# EAGLE design master (EAGLE 5.11)
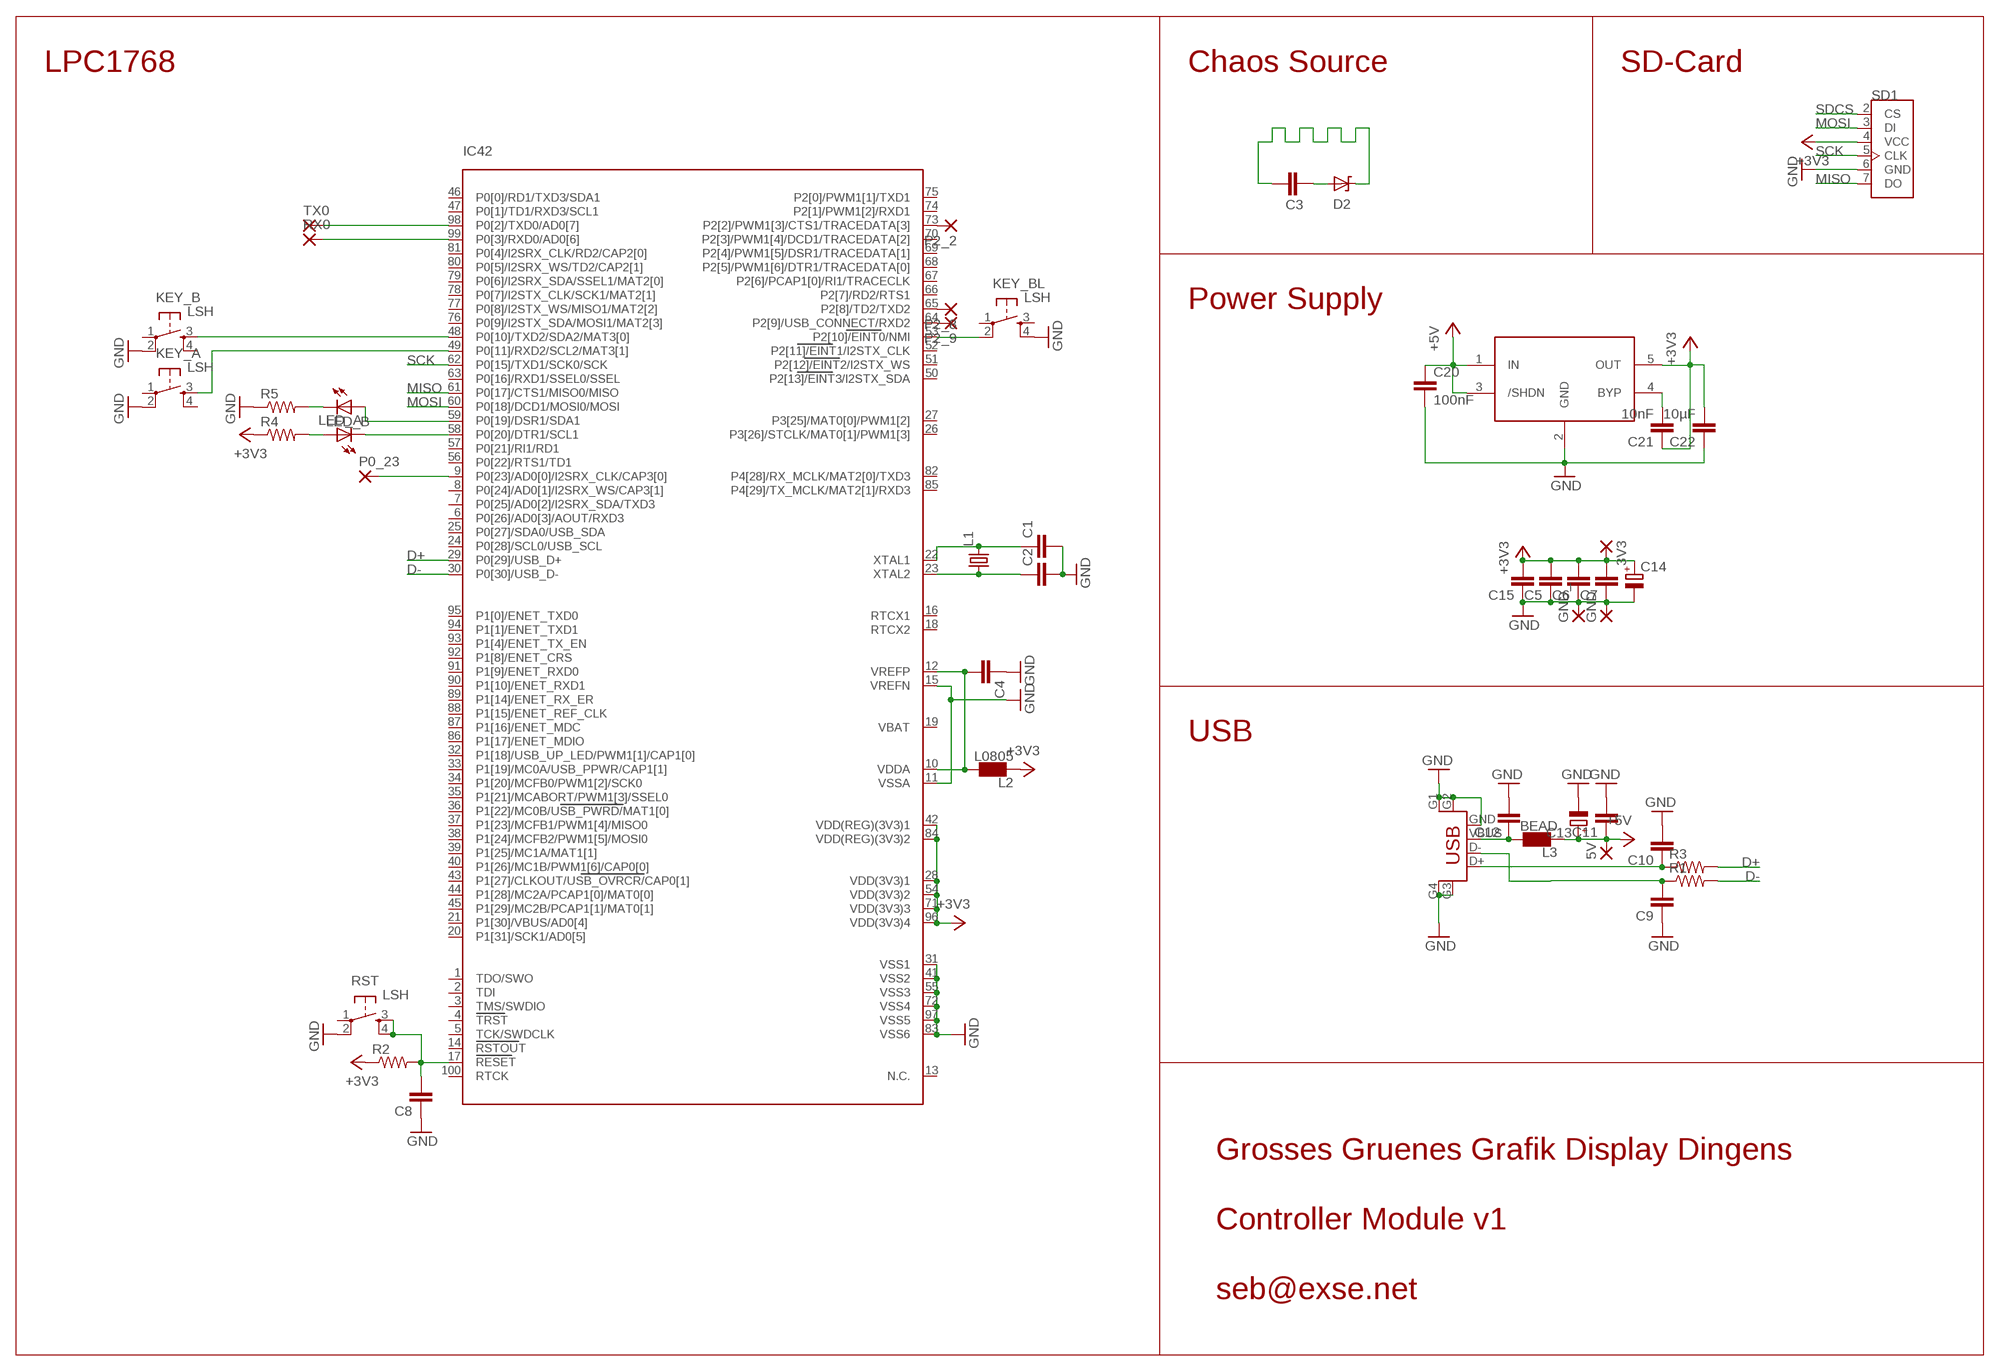
[diagram p0: schematic, sheet 1]

## Parts
3V3  SMD5  [SMD2,54-5,08]
5V  SMD5  [SMD2,54-5,08]
C1  CAP0805  [0805]
C2  CAP0805  [0805]
C3  CAP0805  [0805]
C4  CAP0805  [0805]
C5  CAP0805  [0805]
C6  CAP0805  [0805]
C7  CAP0805  [0805]
C8  CAP0805  [0805]
C9  CAP0805  [0805]
C10  CAP0805  [0805]
C11  CAP0805  [0805]
C12  CAP0805  [0805]
C13  CPOL-EUSMCC  [SMC_C]
C14  CPOL-EUSMCC  [SMC_C]
C15  CAP0805  [0805]
C20  100nF  CAP0805  [0805]
C21  10nF  CAP0805  [0805]
C22  10µF  CAP0805  [0805]
D2  DIODE-ZENER-BZT52  [SOD-323]
GND  SMD5  [SMD2,54-5,08]
GND_  SMD5  [SMD2,54-5,08]
IC23  LT1761  [SOT23-5L]
IC42  LPC1768  [LQFP100]
KEY_A  LSH  [LSH]
KEY_B  LSH  [LSH]
KEY_BL  LSH  [LSH]
L1  X22-OSCILLATOR  [X22]
L2  L0805  [0805]
L3  BEAD  [0805]
LED_A  LEDCHIPLED_0805  [CHIPLED_0805]
LED_B  LEDCHIPLED_0805  [CHIPLED_0805]
P0_23  SMD5  [SMD2,54-5,08]
P2_2  SMD5  [SMD2,54-5,08]
P2_8  SMD5  [SMD2,54-5,08]
P2_9  SMD5  [SMD2,54-5,08]
R1  RESISTOR0805-RES  [0805]
R2  RESISTOR0805-RES  [0805]
R3  RESISTOR0805-RES  [0805]
R4  RESISTOR0805-RES  [0805]
R5  RESISTOR0805-RES  [0805]
RST  LSH  [LSH]
RX0  SMD5  [SMD2,54-5,08]
SD1  MICROSD_SF-MICROSD  [MICROSD_MICROSD]
TX0  SMD5  [SMD2,54-5,08]
X1  USB-SMD-NS  [USB-MINIB-NOSTOP]

## Nets
+3V3: 3V3.1(P) C5.2 C6.2 C7.2 C14.+ C15.2 C21.1 C22.2 IC23.5(OUT) IC42.28(VDD(3V3)1) IC42.42(VDD(REG)(3V3)1) IC42.54(VDD(3V3)2) IC42.71(VDD(3V3)3) IC42.84(VDD(REG)(3V3)2) IC42.96(VDD(3V3)4) L2.2 R2.1 R4.1 SD1.4(VCC)
+5V: 5V.1(P) C11.1 C13.+ C20.1 IC23.1(IN) IC23.3(/SHDN) L3.2
D+: IC42.29(P0[29]/USB_D+) R3.2
D-: IC42.30(P0[30]/USB_D-) R1.2
GND: C1.2 C2.2 C4.1 C5.1 C6.1 C7.1 C8.1 C9.1 C10.2 C11.2 C12.2 C13.- C14.- C15.1 C20.2 C22.1 GND.1(P) GND_.1(P) IC23.2(GND) IC42.11(VSSA) IC42.15(VREFN) IC42.31(VSS1) IC42.41(VSS2) IC42.55(VSS3) IC42.72(VSS4) IC42.83(VSS6) IC42.97(VSS5) KEY_A.2 KEY_B.2 KEY_BL.4 R5.1 RST.2 SD1.6(GND) X1.G1(GND) X1.G2(GND) X1.G3(GND) X1.G4(GND) X1.GND
MISO: IC42.61(P0[17]/CTS1/MISO0/MISO) SD1.7(DO)
MOSI: IC42.60(P0[18]/DCD1/MOSI0/MOSI) SD1.3(DI)
N$1: C1.1 IC42.22(XTAL1) L1.3
N$2: C2.1 IC42.23(XTAL2) L1.1
N$3: C9.2 R1.1 X1.D-
N$4: IC42.53(P2[10]/EINT0/NMI) KEY_BL.2
N$5: C10.1 R3.1 X1.D+
N$6: C4.2 IC42.10(VDDA) IC42.12(VREFP) L2.1
N$7: C3.2 D2.1(C)
N$8: IC42.99(P0[3]/RXD0/AD0[6]) RX0.1(P)
N$9: C12.1 L3.1 X1.VBUS
N$10: IC42.98(P0[2]/TXD0/AD0[7]) TX0.1(P)
N$11: IC42.9(P0[23]/AD0[0]/I2SRX_CLK/CAP3[0]) P0_23.1(P)
N$12: C8.2 IC42.17(RESET) R2.2 RST.3 RST.4
N$13: IC42.48(P0[10]/TXD2/SDA2/MAT3[0]) KEY_B.3
N$14: IC42.49(P0[11]/RXD2/SCL2/MAT3[1]) KEY_A.3
N$15: IC42.58(P0[20]/DTR1/SCL1) LED_A.C
N$16: IC42.59(P0[19]/DSR1/SDA1) LED_B.A
N$17: LED_A.A R4.2
N$18: LED_B.C R5.2
N$19: IC42.64(P2[9]/USB_CONNECT/RXD2) P2_9.1(P)
N$20: IC42.65(P2[8]/TD2/TXD2) P2_8.1(P)
N$21: IC42.73(P2[2]/PWM1[3]/CTS1/TRACEDATA[3]) P2_2.1(P)
N$22: C3.1 D2.2(A)
N$43: C21.2 IC23.4(BYP)
SCK: IC42.62(P0[15]/TXD1/SCK0/SCK) SD1.5(CLK)
SDCS: SD1.2(CS)
Unconnected: IC42.1(TDO/SWO) IC42.2(TDI) IC42.3(TMS/SWDIO) IC42.4(TRST) IC42.5(TCK/SWDCLK) IC42.6(P0[26]/AD0[3]/AOUT/RXD3) IC42.7(P0[25]/AD0[2]/I2SRX_SDA/TXD3) IC42.8(P0[24]/AD0[1]/I2SRX_WS/CAP3[1]) IC42.13(N.C.) IC42.14(RSTOUT) IC42.16(RTCX1) IC42.18(RTCX2) IC42.20(P1[31]/SCK1/AD0[5]) IC42.21(P1[30]/VBUS/AD0[4]) IC42.24(P0[28]/SCL0/USB_SCL) IC42.25(P0[27]/SDA0/USB_SDA) IC42.26(P3[26]/STCLK/MAT0[1]/PWM1[3]) IC42.27(P3[25]/MAT0[0]/PWM1[2]) IC42.32(P1[18]/USB_UP_LED/PWM1[1]/CAP1[0]) IC42.33(P1[19]/MC0A/USB_PPWR/CAP1[1]) IC42.34(P1[20]/MCFB0/PWM1[2]/SCK0) IC42.35(P1[21]/MCABORT/PWM1[3]/SSEL0) IC42.36(P1[22]/MC0B/USB_PWRD/MAT1[0]) IC42.37(P1[23]/MCFB1/PWM1[4]/MISO0) IC42.38(P1[24]/MCFB2/PWM1[5]/MOSI0) IC42.39(P1[25]/MC1A/MAT1[1]) IC42.40(P1[26]/MC1B/PWM1[6]/CAP0[0]) IC42.43(P1[27]/CLKOUT/USB_OVRCR/CAP0[1]) IC42.44(P1[28]/MC2A/PCAP1[0]/MAT0[0]) IC42.45(P1[29]/MC2B/PCAP1[1]/MAT0[1]) IC42.46(P0[0]/RD1/TXD3/SDA1) IC42.47(P0[1]/TD1/RXD3/SCL1) IC42.50(P2[13]/EINT3/I2STX_SDA) IC42.51(P2[12]/EINT2/I2STX_WS) IC42.52(P2[11]/EINT1/I2STX_CLK) IC42.56(P0[22]/RTS1/TD1) IC42.57(P0[21]/RI1/RD1) IC42.63(P0[16]/RXD1/SSEL0/SSEL) IC42.66(P2[7]/RD2/RTS1) IC42.67(P2[6]/PCAP1[0]/RI1/TRACECLK) IC42.68(P2[5]/PWM1[6]/DTR1/TRACEDATA[0]) IC42.69(P2[4]/PWM1[5]/DSR1/TRACEDATA[1]) IC42.70(P2[3]/PWM1[4]/DCD1/TRACEDATA[2]) IC42.74(P2[1]/PWM1[2]/RXD1) IC42.75(P2[0]/PWM1[1]/TXD1) IC42.76(P0[9]/I2STX_SDA/MOSI1/MAT2[3]) IC42.77(P0[8]/I2STX_WS/MISO1/MAT2[2]) IC42.78(P0[7]/I2STX_CLK/SCK1/MAT2[1]) IC42.79(P0[6]/I2SRX_SDA/SSEL1/MAT2[0]) IC42.80(P0[5]/I2SRX_WS/TD2/CAP2[1]) IC42.81(P0[4]/I2SRX_CLK/RD2/CAP2[0]) IC42.82(P4[28]/RX_MCLK/MAT2[0]/TXD3) IC42.85(P4[29]/TX_MCLK/MAT2[1]/RXD3) IC42.86(P1[17]/ENET_MDIO) IC42.87(P1[16]/ENET_MDC) IC42.88(P1[15]/ENET_REF_CLK) IC42.89(P1[14]/ENET_RX_ER) IC42.90(P1[10]/ENET_RXD1) IC42.91(P1[9]/ENET_RXD0) IC42.92(P1[8]/ENET_CRS) IC42.93(P1[4]/ENET_TX_EN) IC42.94(P1[1]/ENET_TXD1) IC42.95(P1[0]/ENET_TXD0) IC42.100(RTCK) KEY_A.1 KEY_A.4 KEY_B.1 KEY_B.4 KEY_BL.1 KEY_BL.3 RST.1

## Notes on the sheet
- LPC1768 | Chaos Source | SD-Card
- Power Supply
- USB
- Grosses Gruenes Grafik Display Dingens
- Controller Module v1
- seb@exse.net

## Power pins joined to a net without a drawn wire
VBAT: IC42.19(VBAT)

## Library data of the parts
3V3 5V GND GND_ P0_23 P2_2 P2_8 P2_9 RX0 TX0 = wirepad:SMD5: SMD PAD
C1-C12 C15 C20-C22 = SparkFun:CAP: Capacitor Standard 0603 ceramic capacitor, and 0.1" leaded capacitor.
C13 C14 = rcl:CPOL-EU: POLARIZED CAPACITOR, European symbol
D2 = SparkFun:DIODE-ZENER: Zener Diode Production Part - 8199 3.4V Zener Voltage
IC23 = seb:LT1761
IC42 = microbuilder:LPC1768: LPC1768 100 MHz 32-bit ARM Cortex-M3 based microcontroller featuring a high level of integration and low power consumption. 512 kB Flash, 64 kB SRAM, USB Device/Host/OTG, Ethernet, CAN, I2S, 10-bit DAC Digikey: 568-4796-ND
KEY_A KEY_B KEY_BL RST = switch-tact:LSH
L1 = seb:X22-OSCILLATOR
L2 = seb:L0805
L3 = seb:BEAD
LED_A LED_B = led:LED: LED OSRAM: - CHIPLED LG R971, LG N971, LY N971, LG Q971, LY Q971, LO R971, LY R971 LH N974, LH R974 LS Q976, LO Q976, LY Q976 LO Q996 - Hyper CHIPLED LW Q18S LB Q993, LB Q99A, LB R99A - SideLED LS A670, LO A670, LY A670, LG A670, LP A670 LB A673, LV A673, LT A673, LW A673 LH A674 LY A675 LS A676, LA A676, LO A676, LY A676, LW A676 LS A679, LY A679, LG A679 - Hyper Micro SIDELED® LS Y876, LA Y876, LO Y876, LY Y876 LT Y87S - SmartLED LW L88C, LW L88S LB L89C, LB L89S, LG L890 LS L89K, LO L89K, LY L89K LS L896, LA L896, LO L896, LY L896 - TOPLED LS T670, LO T670, LY T670, LG T670, LP T670 LSG T670, LSP T670, LSY T670, LOP T670, LYG T670 LG T671, LOG T671, LSG T671 LB T673, LV T673, LT T673, LW T673 LH T674 LS T676, LA T676, LO T676, LY T676, LB T676, LH T676, LSB T676, LW T676 LB T67C, LV T67C, LT T67C, LS T67K, LO T67K, LY T67K, LW E67C LS E67B, LA E67B, LO E67B, LY E67B, LB E67C, LV E67C, LT E67C LW T67C LS T679, LY T679, LG T679 LS T770, LO T770, LY T770, LG T770, LP T770 LB T773, LV T773, LT T773, LW T773 LH T774 LS E675, LA E675, LY E675, LS T675 LS T776, LA T776, LO T776, LY T776, LB T776 LHGB T686 LT T68C, LB T68C - Hyper Mini TOPLED® LB M676 - Mini TOPLED Santana® LG M470 LS M47K, LO M47K, LY M47K Source: http://www.osram.convergy.de LUXEON: - LUMILED® LXK2-PW12-R00, LXK2-PW12-S00, LXK2-PW14-U00, LXK2-PW14-V00 LXK2-PM12-R00, LXK2-PM12-S00, LXK2-PM14-U00 LXK2-PE12-Q00, LXK2-PE12-R00, LXK2-PE12-S00, LXK2-PE14-T00, LXK2-PE14-U00 LXK2-PB12-K00, LXK2-PB12-L00, LXK2-PB12-M00, LXK2-PB14-N00, LXK2-PB14-P00, LXK2-PB14-Q00 LXK2-PR12-L00, LXK2-PR12-M00, LXK2-PR14-Q00, LXK2-PR14-R00 LXK2-PD12-Q00, LXK2-PD12-R00, LXK2-PD12-S00 LXK2-PH12-R00, LXK2-PH12-S00 LXK2-PL12-P00, LXK2-PL12-Q00, LXK2-PL12-R00 Source: www.luxeon.com KINGBRIGHT: KA-3528ASYC Source: www.kingbright.com
R1-R5 = SparkFun:RESISTOR: Resistor Basic schematic elements and footprints for 0603, 1206, and PTH resistors.
SD1 = sd:MICROSD_SF-MICROSD
X1 = SparkFun:USB: USB Connectors USB-B-PTH is fully proven SKU : PRT-00139 USB-miniB is fully proven SKU : PRT-00587 USB-A-PCB is untested. USB-A-H is throughly reviewed, but untested. Spark Fun Electronics SKU : PRT-00437 USB-B-SMT is throughly reviewed, but untested. Needs silkscreen touching up. USB-A-S has not been used/tested USB-MB-H has not been used/tested

## Net classes
1 FAT: width 0.2 mm, drill 0.4 mm
2 GND/3V3: width 0.2 mm, drill 0.4 mm

## Board
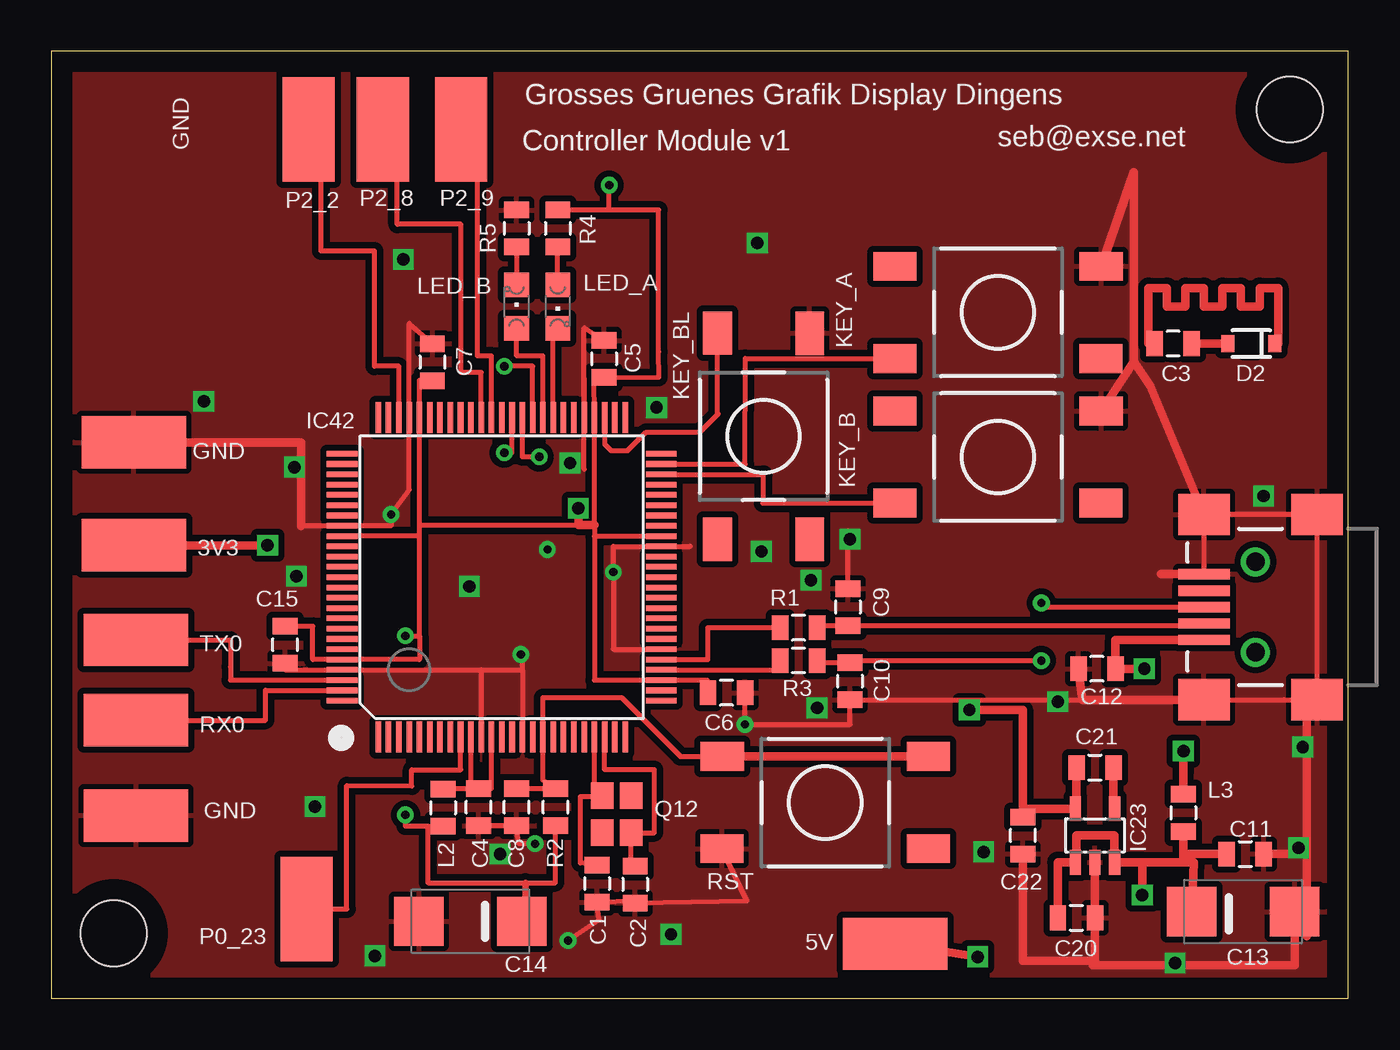
[diagram p1: board, top side]
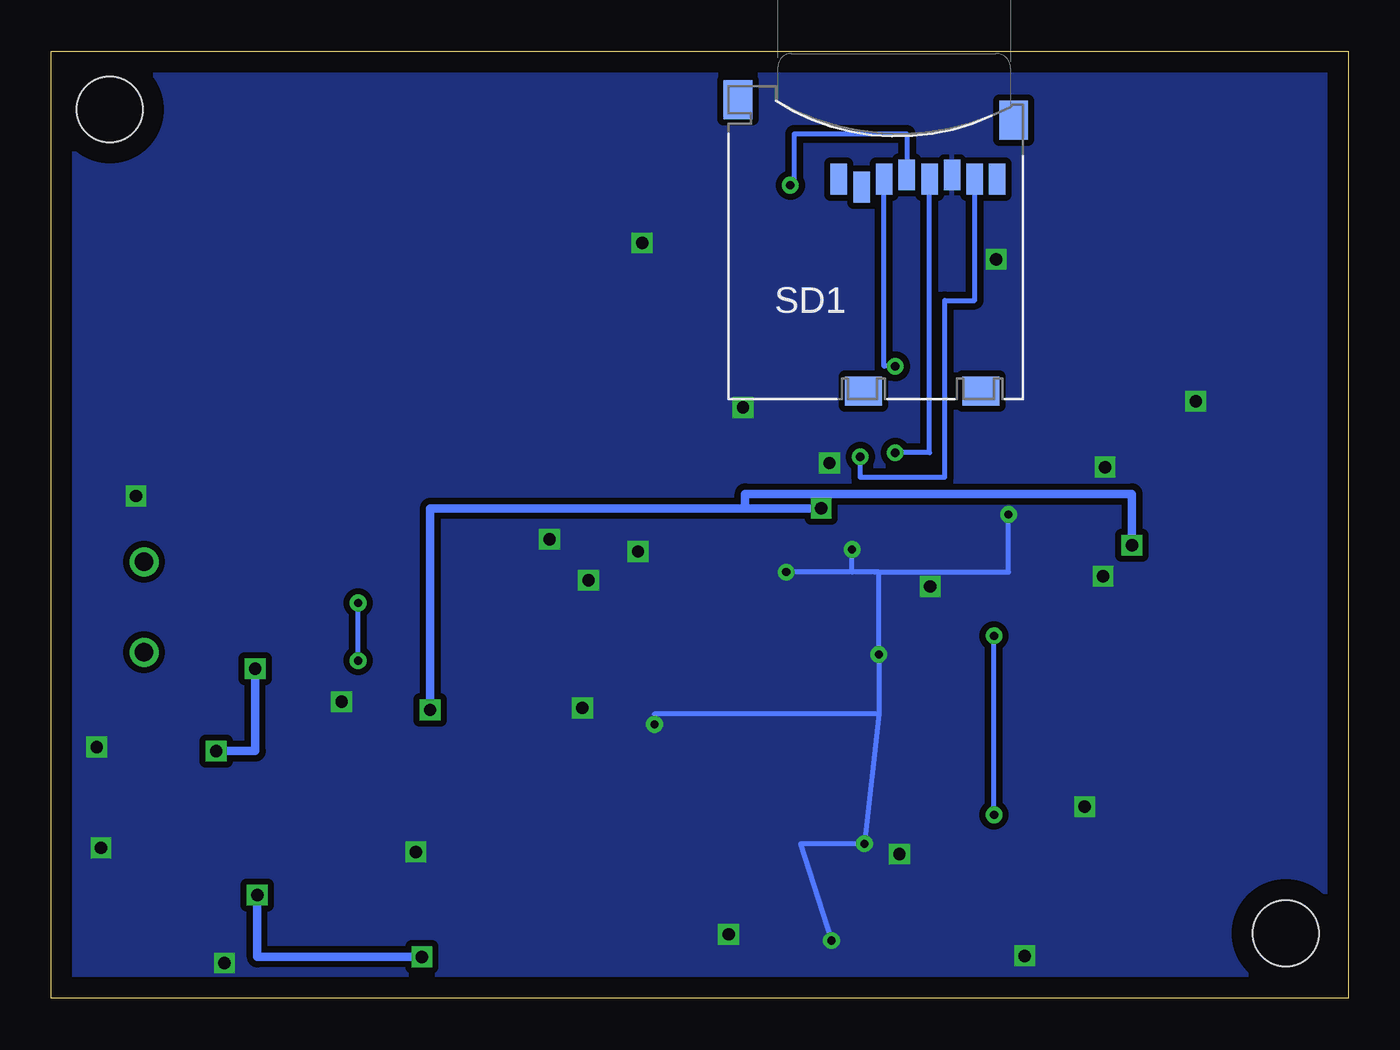
[diagram p2: board, bottom side, seen from below]

Size 63 x 46 mm. Coordinates in mm from the lower left corner, seen from the top.
Outline: 0,0 63,0 63,46 0,46 0,0
Copper layers (1*16): Top 0.035mm / dielectric 1.5mm / Bottom 0.035mm
Design rules "default *": minimum track width 10mil, minimum drill 0.4mm, track to track 8mil, track to pad 8mil, pad to pad 8mil, via to via 8mil, smd to smd 8mil, copper to edge 40mil, drill to drill 8mil, minimum pad ring 10mil, minimum via ring 8mil, stop-mask expansion 4mil, vias tented up to drill 40mil, thermal gap 10mil
Holes 3.2 mm at 3.03,3.15 60.16,43.18
tRestrict: 2 lines

### Footprints (pad centres in the part's own frame; a part is rotated, then mirrored left to right if it is on the bottom)
SMD2,54-5,08 = smd 2.54 x 5.08: 1 0,0
0805 = smd 0.8 x 1.2: 1 -0.9,0; 2 0.9,0
SMC_C = smd 2.4 x 2.4: + -2.5,0; - 2.5,0
SOD-323 = smd 0.63 x 0.83: 1 -1.15,0; 2 1.15,0
SOT23-5L = smd 0.55 x 1.2: 1 -0.95,-1.3; 2 0,-1.3; 3 0.95,-1.3; 4 0.95,1.3; 5 -0.95,1.3
LQFP100 = smd 0.27 x 1.5: 1 -6,-7.75; 2 -5.5,-7.75; 3 -5,-7.75; 4 -4.5,-7.75; 5 -4,-7.75; 6 -3.5,-7.75; 7 -3,-7.75; 8 -2.5,-7.75; 9 -2,-7.75; 10 -1.5,-7.75; 11 -1,-7.75; 12 -0.5,-7.75; 13 0,-7.75; 14 0.5,-7.75; 15 1,-7.75; 16 1.5,-7.75; 17 2,-7.75; 18 2.5,-7.75; 19 3,-7.75; 20 3.5,-7.75; 21 4,-7.75; 22 4.5,-7.75; 23 5,-7.75; 24 5.5,-7.75; 25 6,-7.75; 51 6,7.75; 52 5.5,7.75; 53 5,7.75; 54 4.5,7.75; 55 4,7.75; 56 3.5,7.75; 57 3,7.75; 58 2.5,7.75; 59 2,7.75; 60 1.5,7.75; 61 1,7.75; 62 0.5,7.75; 63 0,7.75; 64 -0.5,7.75; 65 -1,7.75; 66 -1.5,7.75; 67 -2,7.75; 68 -2.5,7.75; 69 -3,7.75; 70 -3.5,7.75; 71 -4,7.75; 72 -4.5,7.75; 73 -5,7.75; 74 -5.5,7.75; 75 -6,7.75 | smd 1.5 x 0.27: 26 7.75,-6; 27 7.75,-5.5; 28 7.75,-5; 29 7.75,-4.5; 30 7.75,-4; 31 7.75,-3.5; 32 7.75,-3; 33 7.75,-2.5; 34 7.75,-2; 35 7.75,-1.5; 36 7.75,-1; 37 7.75,-0.5; 38 7.75,0; 39 7.75,0.5; 40 7.75,1; 41 7.75,1.5; 42 7.75,2; 43 7.75,2.5; 44 7.75,3; 45 7.75,3.5; 46 7.75,4; 47 7.75,4.5; 48 7.75,5; 49 7.75,5.5; 50 7.75,6; 76 -7.75,6; 77 -7.75,5.5; 78 -7.75,5; 79 -7.75,4.5; 80 -7.75,4; 81 -7.75,3.5; 82 -7.75,3; 83 -7.75,2.5; 84 -7.75,2; 85 -7.75,1.5; 86 -7.75,1; 87 -7.75,0.5; 88 -7.75,0; 89 -7.75,-0.5; 90 -7.75,-1; 91 -7.75,-1.5; 92 -7.75,-2; 93 -7.75,-2.5; 94 -7.75,-3; 95 -7.75,-3.5; 96 -7.75,-4; 97 -7.75,-4.5; 98 -7.75,-5; 99 -7.75,-5.5; 100 -7.75,-6
LSH = smd 2.1 x 1.4: 1 -5.005,2.24; 2 5.015,2.24; 3 -5.005,-2.24; 4 5.005,-2.24
X22 = smd 1.3 x 1.1: 1 0.9,0.7; 2 -0.9,0.7; 3 -0.9,-0.7; 4 0.9,-0.7
CHIPLED_0805 = smd 1.2 x 1.2: A 0,-1.05; C 0,1.05
MICROSD_MICROSD = smd 0.8 x 1.5: 1 -1.94,2.7; 2 -0.84,2.3; 3 0.26,2.7; 4 1.36,2.9; 5 2.46,2.7; 6 3.56,2.9; 7 4.66,2.7; 8 5.76,2.7 | smd 1.4 x 1.9: NC -6.85,6.55; NC3 6.55,5.55 | smd 1.8 x 1.4: NC1 -0.75,-7.6; NC2 4.95,-7.6
USB-MINIB-NOSTOP = smd 2.5 x 0.5: D+ 2.5,0; D- 2.5,0.8; GND 2.5,-1.6; ID 2.5,-0.8; VBUS 2.5,1.6 | smd 2.5 x 2: G1 -3,-4.5; G2 -3,4.5; G3 2.5,4.5; G4 2.5,-4.5 | drill 0.9 pad 0.8 round: H1 0,2.2 | drill 0.9 pad 0.787 round: H2 0,-2.2

### Placement (x,y rotation side)
3V3  4,22 90 top
5V  41,2.64 90 top
C1  26.51,5.56 270 top
C2  28.36,5.52 270 top
C3  54.5,31.8 180 top
C4  20.75,9.28 90 top
C5  26.85,31.06 270 top
C6  32.8,14.84 180 top
C7  18.51,30.9 270 top
C8  22.6,9.28 90 top
C9  38.7,19 270 top
C10  38.8,15.4 270 top
C11  58,7 0 top
C12  50.8,16 180 top
C13  57.9,4.2 0 top
C14  20.36,3.73 180 top
C15  11.35,17.17 90 top
C20  49.8,3.9 0 top
C21  50.7,11.2 0 top
C22  47.2,7.9 90 top
D2  58.3,31.8 180 top
GND  4,27 90 top
GND_  4.11,8.87 90 top
IC23  50.7,7.9 0 top
IC42  21.88,20.45 0 top
KEY_A  45.99,33.32 0 top
KEY_B  45.99,26.29 0 top
KEY_BL  34.6,27.3 90 top
L1  27.47,8.94 270 top
L2  19.03,9.25 270 top
L3  55,9 270 top
LED_A  24.6,33.6 180 top
LED_B  22.6,33.6 0 top
P0_23  12.4,4.33 0 top
P2_2  12.5,42.2 0 top
P2_8  16.1,42.2 0 top
P2_9  19.9,42.2 0 top
R1  36.3,18 180 top
R2  24.49,9.28 90 top
R3  36.3,16.4 180 top
R4  24.6,37.4 270 top
R5  22.6,37.4 270 top
RST  37.6,9.5 180 top
RX0  4.1,13.5 90 top
SD1  22.8,37.1 0 bottom
TX0  4.1,17.4 90 top
X1  58.5,19 180 top

### Tracks (layer width: path | path; a pad name or v marks a point on that pad's centre or on a via)
+3V3  (via drill 0.4, 0.6)
  Top 0.254: 17.88,22.45 17.88,23 | 17.88,23 IC42.71 17.88,30.01 C7.2 | 17.88,22.45 IC42.84 | 17.88,17.6 17.88,16.45 IC42.96 12.7,16.45 12.7,18.07 C15.2 | 17.88,22.45 17.88,17.9 17.88,17.6 | 26.38,23 IC42.54 26.37,30.19 C5.2 29.52,30.17 29.5,31.4 29.5,38.3 27.3,38.3 27.1,38.3 | 17.88,23 26.38,23 | 26.38,22.45 IC42.42 | 26.38,23 26.38,22.45 | 26.38,22.45 26.38,15.45 IC42.28 31.86,15.45 C6.2 | 18.3,8.35 L2.2 | R2.1 24.49,5.6 23.03,5.6 18.3,5.6 18.3,8.35 | 18.3,8.35 17.2,8.35 v17.2,8.9 | v17.2,17.6 17.88,17.6 | 27.1,38.3 R4.1 | 27.1,38.3 v27.1,39.5
  Top 0.305: C14.+ 23.03,3.73 23.03,5.6
  Top 0.406: C21.1 49.8,9.2 IC23.5 47.2,9.2 | 47.2,9.2 C22.2 | 47.2,9.2 47.2,14 v44.6,14 | v25.6,23.8 25.6,23 26.38,23 | v10.5,22 3V3.1
  Bottom 0.254: v17.2,8.9 v17.2,17.6 | SD1.4 21.44,42 26.9,42 26.9,39.5 v27.1,39.5
  Bottom 0.406: v44.6,14 44.6,23.8 29.3,23.8 | v25.6,23.8 29.3,23.8 | v10.5,22 10.5,24.5 29.3,24.5 29.3,23.8
+5V  (via drill 0.6)
  Top 0.406: C20.1 48.9,6.6 IC23.1 49.8,6.6 49.8,7.9 51.65,7.9 IC23.3 53,6.6 | 55,6.6 L3.2 | 53,6.6 55,6.6 | 55,6.6 55,7 C11.1 | C13.+ 55.5,6.6 55,6.6 | 5V.1 v45,2 | v53,5 53,6.6
  Bottom 0.406: v45,2 53,2 v53,5
D+
  Top 0.254: IC42.29 35.4,15.95 R3.2
D-
  Top 0.254: IC42.30 31.9,16.45 31.9,17.1 31.9,18 R1.2
GND  (via drill 0.4, 0.6)
  Top 0.254: IC42.31 27.3,16.95 v27.3,20.7 27.3,21.95 29.3,21.95 IC42.41 31.03,21.95 | 20.88,15.95 IC42.97 11.35,15.95 C15.1 | 20.88,15.95 IC42.11 | 22.88,15.95 IC42.15 | 20.88,15.95 22.88,15.95 | 22.88,15.95 22.88,16.7 v22.8,16.7 | 25.88,30.08 IC42.55 | 25.88,30.08 25.88,32.58 C5.1 | C7.1 17.38,32.78 IC42.72 17.38,24.7 v16.5,23.5 16.5,22.95 14.5,22.95 IC42.83 12.13,22.95 | C4.1 22.7,8.38 C8.1 22.7,7.5 v23.5,7.5 | v25.1,2.8 26.61,3.8 C1.2 28.36,4.76 C2.2 33.78,4.72 RST.2 | C6.1 v33.7,13.3 38.8,13.3 C10.2 50.1,14.5 | C9.1 38.7,22.7 | X1.GND X1.G4 X1.G1 X1.G2 61,14.5 X1.G3 59.9,14.5 | 25.88,25.7 25.88,30.08
  Top 0.406: IC23.2 C20.2 50.7,2.9 50.7,2.7 50.7,1.8 | 50.7,1.8 47.2,1.8 C22.1 | 57.1,14.5 X1.G3 50.1,14.5 C12.2 | KEY_A.2 52.6,40.14 52.6,30.94 | 52.6,30.94 KEY_B.2 | X1.G4 53.4,29.74 52.6,30.94 | 50.7,1.8 50.6,1.6 60.4,1.6 C13.- 61,3 61,7 | 61,14.5 61,7 | 61,7 C11.2 | GND.1 12.13,27 12.13,22.95 | X1.GND 53.9,20.6
  Bottom 0.254: 24.1,20.7 v27.3,20.7 | 24.1,20.7 v24.1,21.8 | v16.5,23.5 16.5,20.7 22.8,20.7 | 24.1,20.7 23,20.7 22.8,20.7 | 22.8,20.7 v22.8,16.7 22.8,13.8 | 22.8,13.8 v23.5,7.5 26.6,7.5 v25.1,2.8 | v33.7,13.3 33.7,13.8 22.8,13.8
  other vias: 7.4,29 11.8,25.8 11.9,20.5 20.3,20 25.2,26 34.5,21.7 38.8,22.3 15.72,2.05 12.8,9.3 17.1,35.9 30.1,3.1 37.2,14.1 36.9,20.3 45.3,7.1 54.6,1.7 60.6,7.3 60.8,12.2 58.9,24.4 48.9,14.4 34.3,36.7 21.8,7 29.4,28.7
  pour Bottom (isolate 0.305): 0,0 63,0 63,46 0,46
  pour Top (isolate 0.305): 0,0 63,0 63,46 0,46
MISO  (via drill 0.4)
  Top 0.254: v23.7,26.3 22.88,26.3 IC42.61
  Bottom 0.254: v23.7,26.3 23.7,25.3 19.6,25.3 19.6,33.9 18.14,33.9 SD1.7
MOSI  (via drill 0.4)
  Top 0.254: IC42.60 23.38,30.7 v22,30.7
  Bottom 0.254: v22,30.7 22.54,30.7 SD1.3
N$1
  Top 0.254: IC42.22 26.38,9.84 L1.3 26.77,9.8 25.7,9.8 25.7,6.56 C1.1
N$2
  Top 0.254: C2.1 28.17,6.52 L1.1 29.3,8.04 29.3,11.1 26.88,11.1 IC42.23
N$3
  Top 0.254: R1.1 37.2,18.1 C9.2 56.6,18.1 56.6,18.2 X1.D-
N$4
  Top 0.254: IC42.53 26.88,26.92 27.2,26.6 28,26.6 28.9,27.5 31.5,27.5 32.4,28.4 32.36,28.44 KEY_BL.2
N$5  (via drill 0.4)
  Top 0.254: R3.1 37.2,16.3 C10.1 38.8,16.4 v48.1,16.4 | v48.1,19.2 48.1,19 X1.D+
  Bottom 0.254: v48.1,16.4 v48.1,19.2
N$6
  Top 0.254: IC42.12 21.38,10.18 C4.2 | IC42.10 20.38,10.18 C4.2 | L2.1 19.03,10.18 C4.2
N$7
  Top 0.406: C3.2 53.3,31.8 53.3,34.5 54.2,34.5 54.2,33.6 55.1,33.6 55.1,34.5 56,34.5 56,33.6 56.9,33.6 56.9,34.5 57.8,34.5 57.8,33.6 58.7,33.6 58.7,34.5 59.6,34.5 59.6,31.8 D2.1
N$8
  Top 0.254: IC42.99 10.4,14.95 10.4,13.7 10.4,13.5 RX0.1
N$9  (via drill 0.6)
  Top 0.406: X1.VBUS 51.7,17.4 C12.1 v53.1,16 | v55,12 55,11 L3.1
  Bottom 0.406: v53.1,16 53.1,12 v55,12
N$10
  Top 0.254: IC42.98 8.7,15.45 8.7,16.1 8.7,17.4 TX0.1
N$11
  Top 0.254: IC42.9 19.88,11.1 17.5,11.1 17.5,10.3 14.35,10.33 14.35,4.33 P0_23.1
N$12
  Top 0.254: C8.2 R2.2 23.88,10.58 IC42.17 23.88,14.6 27.7,14.6 30.56,11.74 RST.4
  Top 0.406: RST.4 RST.3
N$13
  Top 0.254: IC42.48 34.58,25.45 | 34.58,25.45 34.6,25.45 34.58,25.45 | 34.58,25.45 34.57,24.05 KEY_B.3
N$14
  Top 0.254: IC42.49 33.7,25.95 33.72,31.08 | 33.72,31.08 33.72,31.09 33.72,31.08 | 33.72,31.08 KEY_A.3
N$15
  Top 0.254: IC42.58 24.38,32.55 LED_A.C
N$16
  Top 0.254: LED_B.A 22.6,31.2 23.7,31.2 23.88,31.2 IC42.59
N$17
  Top 0.254: LED_A.A R4.2
N$18
  Top 0.254: R5.2 LED_B.C
N$19
  Top 0.254: IC42.64 21.38,31.2 20.7,31.2 20.7,41.7 19.9,41.7 P2_9.1
N$20
  Top 0.254: IC42.65 20.88,30.4 19.9,30.4 19.9,37.6 16.8,37.6 16.8,42.2 P2_8.1
N$21
  Top 0.254: IC42.73 16.88,30.7 15.7,30.7 15.7,36.3 13.1,36.3 13.1,42.2 P2_2.1
N$22
  Top 0.406: D2.2 C3.1
N$43
  Top 0.406: IC23.4 51.6,9.2 C21.2
SCK  (via drill 0.4)
  Top 0.254: v22,26.5 22.38,26.5 IC42.62
  Bottom 0.254: SD1.5 20.34,26.5 v22,26.5

### Text on the board
tNames: Grosses Gruenes Grafik Display Dingens | GND | Controller Module v1 | seb@exse.net | GND | Q12